# Altium project dodongdo.PrjPcb
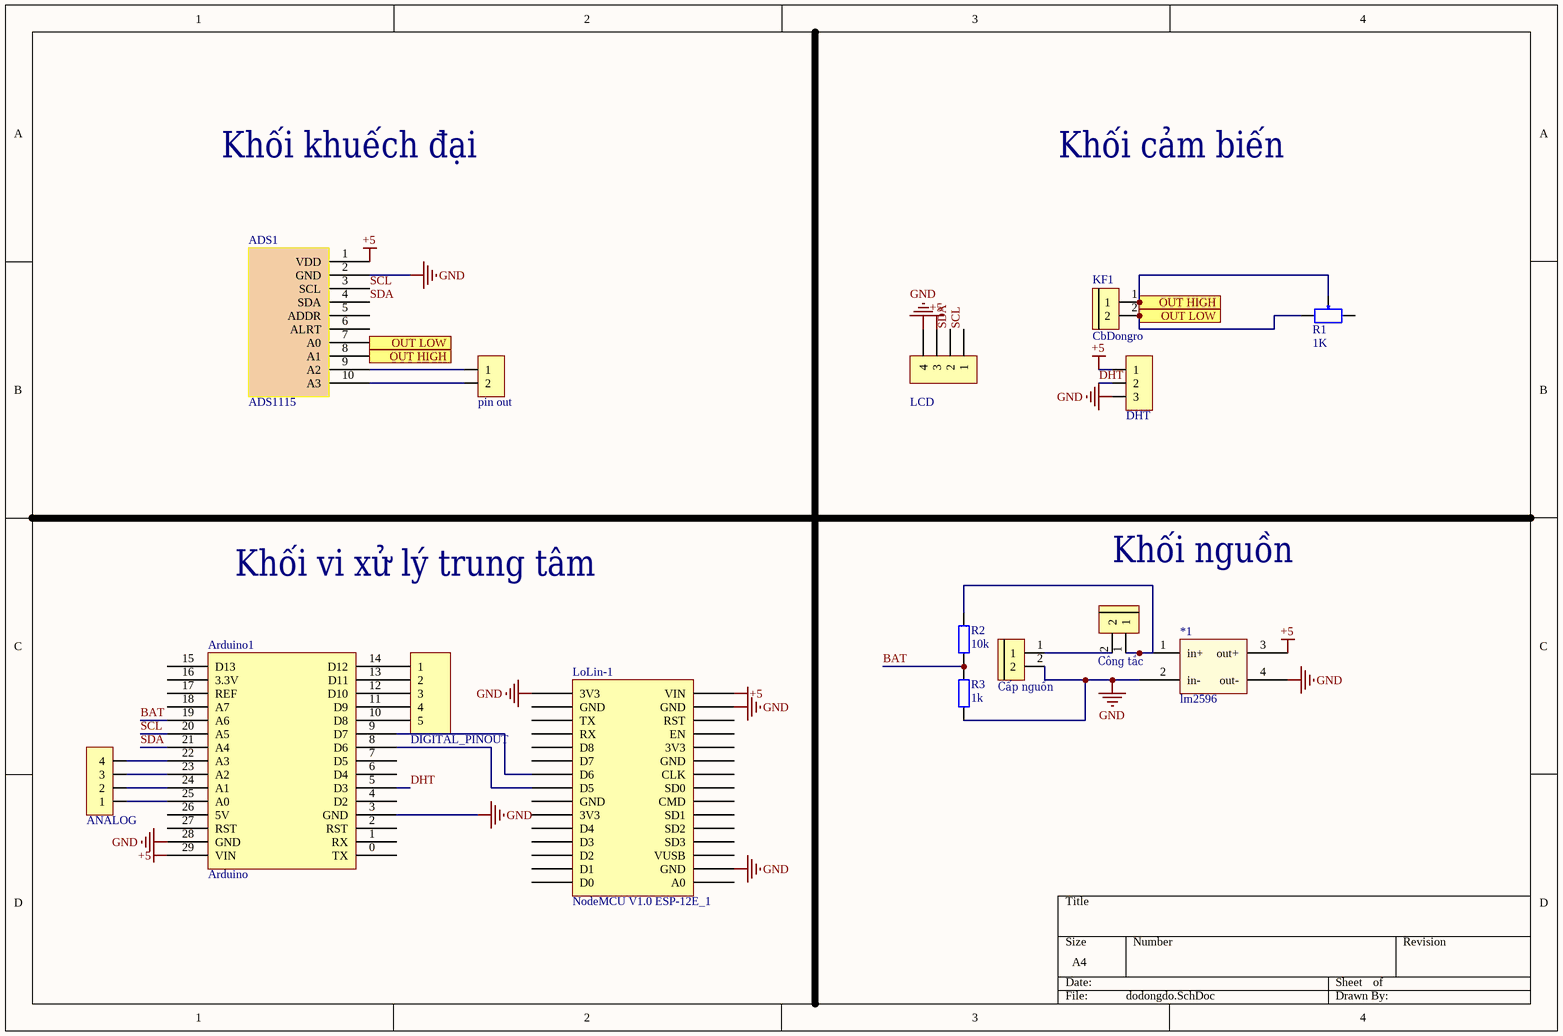
[diagram p0: dodongdo.SchDoc]
1 sheet, 15 parts. Net scope: flat (ports and power ports of the same name join across sheets).
Board file: dodongdo.PcbDoc

## Sheet dodongdo.SchDoc
size A4; SheetNumber: 1; SheetTotal: 1

### Parts
*1  lm2596  [PCBComponent_1]
ADS1  ADS1115  [ads1115]
Arduino1  Arduino  [Nano]
H1  LCD  [XH2.54M-4]
JP1  DHT  [JP 1x3 CT]
JP2  pin out  [JP 1x2 CT]
JP3  DIGITAL_PINOUT  [JP 1x5 DT]
JP4  ANALOG  [JP 1x4 CT]
KF1  CbDongro  [Con 2 KF301 5.08]
KF2  Công tắc  [Con 2 KF301 5.08]
KF3  Cấp nguồn  [Con 2 KF301 5.08]
LoLin-1  NodeMCU V1.0 ESP-12E_1  [LoLin NodeMcu V3]
R1  1K  [Bien Tro Vi Chinh Dung]
R2  10k  [tro vach 1/4w]
R3  1k  [tro vach 1/4w]

### Ports
OUT HIGH, OUT LOW

### Nets
+5: *1.3(out+) ADS1.1(VDD) Arduino1.29(VIN) H1.3 JP1.1 LoLin-1.VIN
GND: *1.2(in-) *1.4(out-) ADS1.2(GND) Arduino1.3(GND) Arduino1.28(GND) H1.4 JP1.3 KF3.2 LoLin-1.3V3 LoLin-1.GND R3.1
BAT: Arduino1.19(A6) R2.1 R3.2
DHT: Arduino1.5(D3) JP1.2
SCL: ADS1.3(SCL) Arduino1.20(A5) H1.1
SDA: ADS1.4(SDA) Arduino1.21(A4) H1.2
Net*1_1: *1.1(in+) KF2.1 R2.2
NetADS1_7: ADS1.7(A0) KF1.2 R1.1 ; port OUT LOW
NetADS1_8: ADS1.8(A1) KF1.1 R1.2 ; port OUT HIGH
NetADS1_9: ADS1.9(A2) JP2.1
NetADS1_10: ADS1.10(A3) JP2.2
NetArduino1_8: Arduino1.8(D6) LoLin-1.D5
NetArduino1_9: Arduino1.9(D7) LoLin-1.D6
NetArduino1_10: Arduino1.10(D8) JP3.5
NetArduino1_11: Arduino1.11(D9) JP3.4
NetArduino1_12: Arduino1.12(D10) JP3.3
NetArduino1_13: Arduino1.13(D11) JP3.2
NetArduino1_14: Arduino1.14(D12) JP3.1
NetArduino1_22: Arduino1.22(A3) JP4.4
NetArduino1_23: Arduino1.23(A2) JP4.3
NetArduino1_24: Arduino1.24(A1) JP4.2
NetArduino1_25: Arduino1.25(A0) JP4.1
NetKF2_2: KF2.2 KF3.1

Not connected (* = marked no-connect by the designer): ADS1 5(ADDR) 6(ALRT); Arduino1 0(TX) 1(RX) 2(RST) 4(D2) 6(D4) 7(D5) 15(D13) 16(3.3V) 17(REF) 18(A7) 26(5V) 27(RST); LoLin-1 A0 CLK CMD D0 D1 D2 D3 D4 D7 D8 EN RST RX SD0 SD1 SD2 SD3 TX VUSB; R1 3

### Notes on the sheet
- Khối khuếch đại
- Khối cảm biến
- Khối vi xử lý trung tâm
- Khối nguồn

### Library data of the parts
Arduino1 = ArduinoNano
H1 = Header 4P 2.54 Duc Thang: Cắm; Ten_Linh_Kien: Header 4P XH2.54-4P Đực Thẳng; Don_Vi: Con; Ma_Hang: MH001285; Chung_Loai: Cắm
JP1 = JP 1x3 2.54 Cai Thang: Cắm; Ten_Linh_Kien: Jump Đơn Cái 2.54MM 1x20P Thẳng; Don_Vi: Con; Ma_Hang: MH004006; Ghi_Chu: *; Kieu_Chan: *; Chung_Loai: Cắm
JP2 = JP 1x2 2.54 Cai Thang: Cắm; Ten_Linh_Kien: Jump Đơn Cái 2.54MM 1x20P Thẳng; Don_Vi: Con; Ma_Hang: MH004006; Ghi_Chu: *; Kieu_Chan: *; Chung_Loai: Cắm
JP3 = JP 1x5 2.54 Duc Thang: Cắm; Ten_Linh_Kien: Jump Đơn Đực 2.54MM 1x40P Thẳng 11MM; Don_Vi: Con; Ma_Hang: MH000903; Ghi_Chu: *; Kieu_Chan: *; Chung_Loai: Cắm
JP4 = JP 1x4 2.54 Cai Thang: Cắm; Ten_Linh_Kien: Jump Đơn Cái 2.54MM 1x20P Thẳng; Don_Vi: Con; Ma_Hang: MH004006; Ghi_Chu: *; Kieu_Chan: *; Chung_Loai: Cắm
KF1 = CON 2 KF301: Cắm; Ma_Hang: MH000987; Ten_Linh_Kien: CON 2 KF301-2P 5.08MM Xanh Dương; Don_Vi: Con; Chung_Loai: Cắm; Ghi_Chu: *; Kieu_Chan: *
KF2 KF3 = CON 2 KF301: Cắm; Ten_Linh_Kien: CON 2 KF301-2P 5.08MM Xanh Dương; Don_Vi: Con; Ma_Hang: MH000987; Ghi_Chu: *; Kieu_Chan: *; Chung_Loai: Cắm
LoLin-1 = NodeMCU V1.0 ESP-12E_1: LoLin NodeMCU V3
R1 = Bien Tro Tinh Chinh 1K Dung: Cắm; Don_Vi: Con; Ten_Linh_Kien: Biến Trở VR 102-1K 3296W; Ma_Hang: MH003234; Chung_Loai: Cắm; Kieu_Chan: *
R2 R3 = Tro Vach 1/4W 5% 1k: Cắm; Don_Vi: Con; So_Chan: 2; Ten_Linh_Kien: Trở Vạch 1/4w 5% 1k; Ma_Hang: MH007390; Chung_Loai: Cắm; Kieu_Chan: *